# EAGLE board MB_2 (EAGLE 9.2.2)
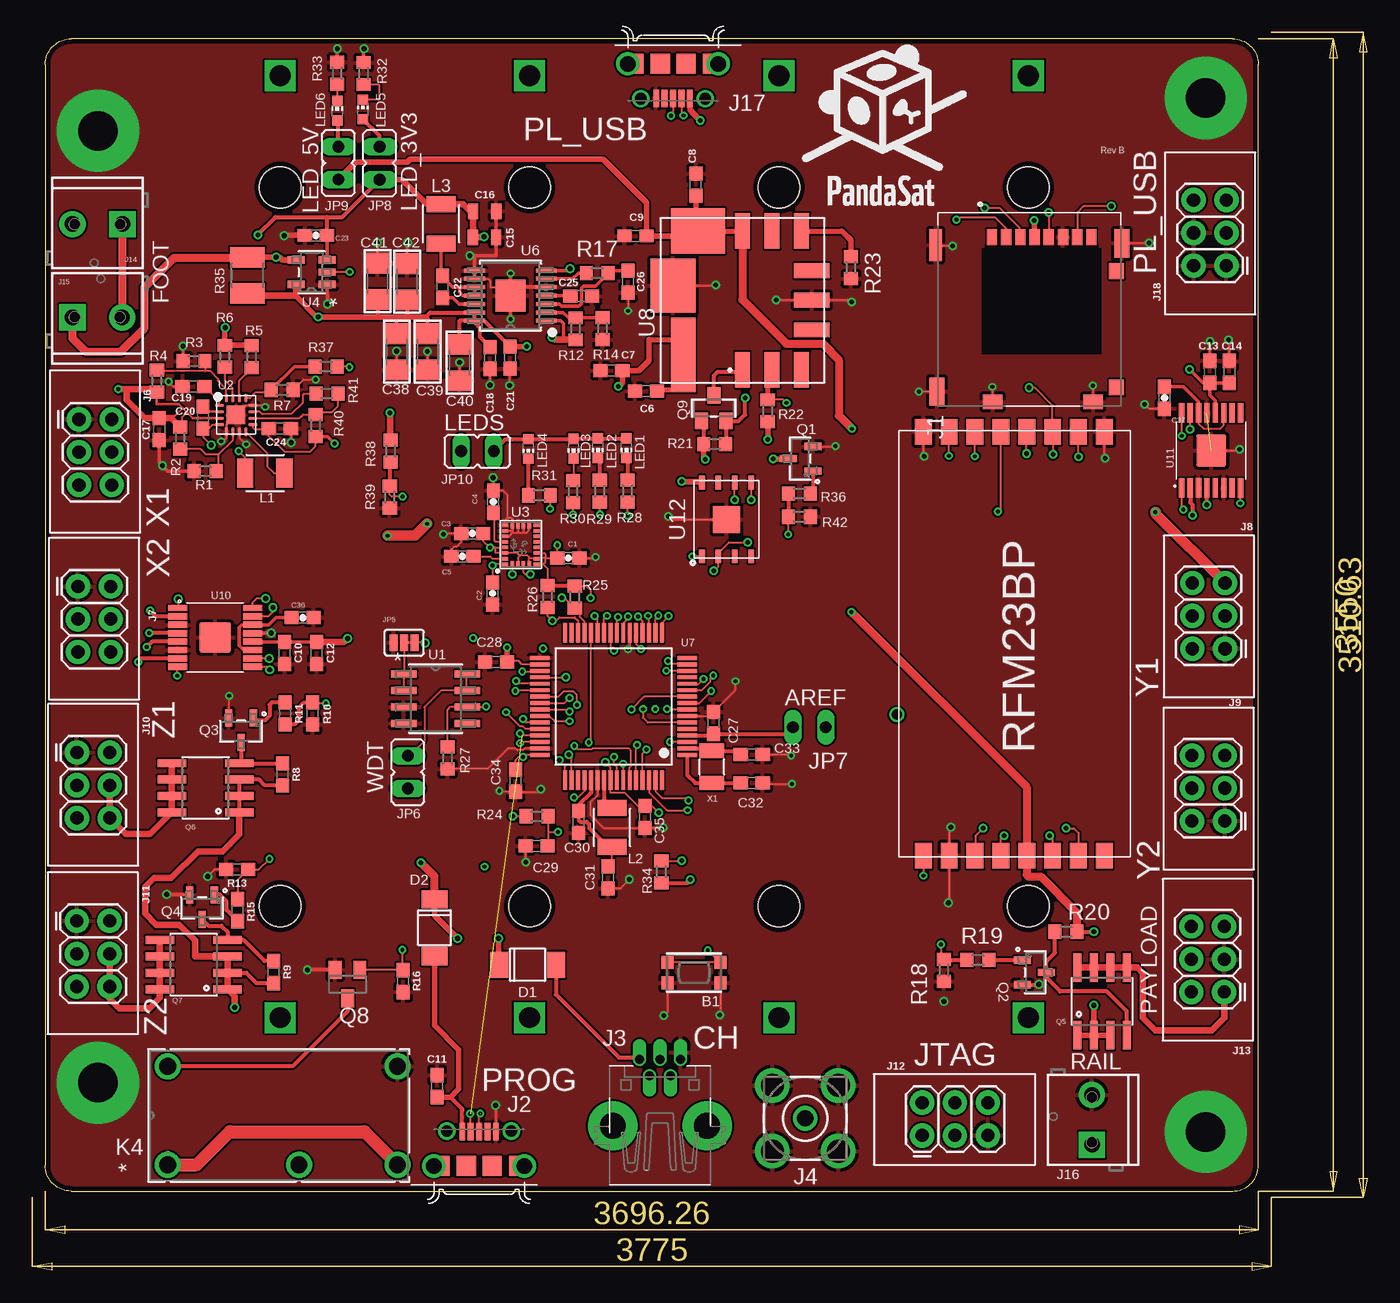
[diagram p4: board, top side]
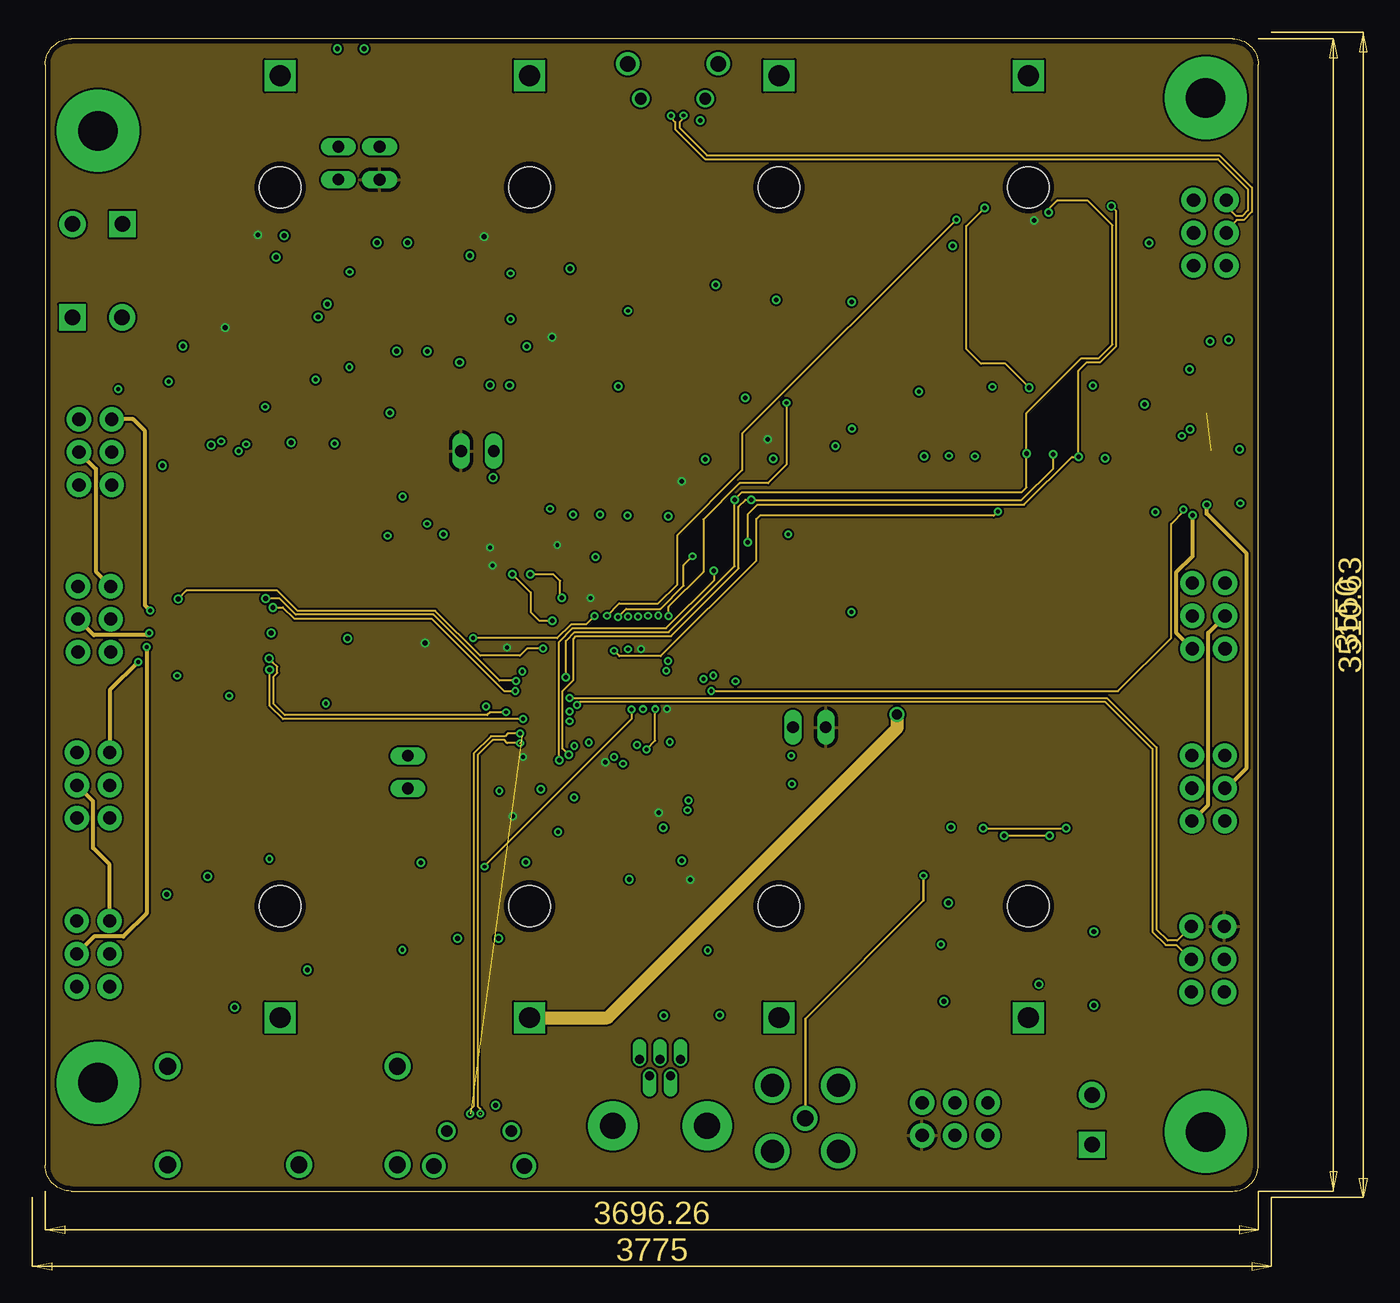
[diagram p5: board, inner layer Route2]
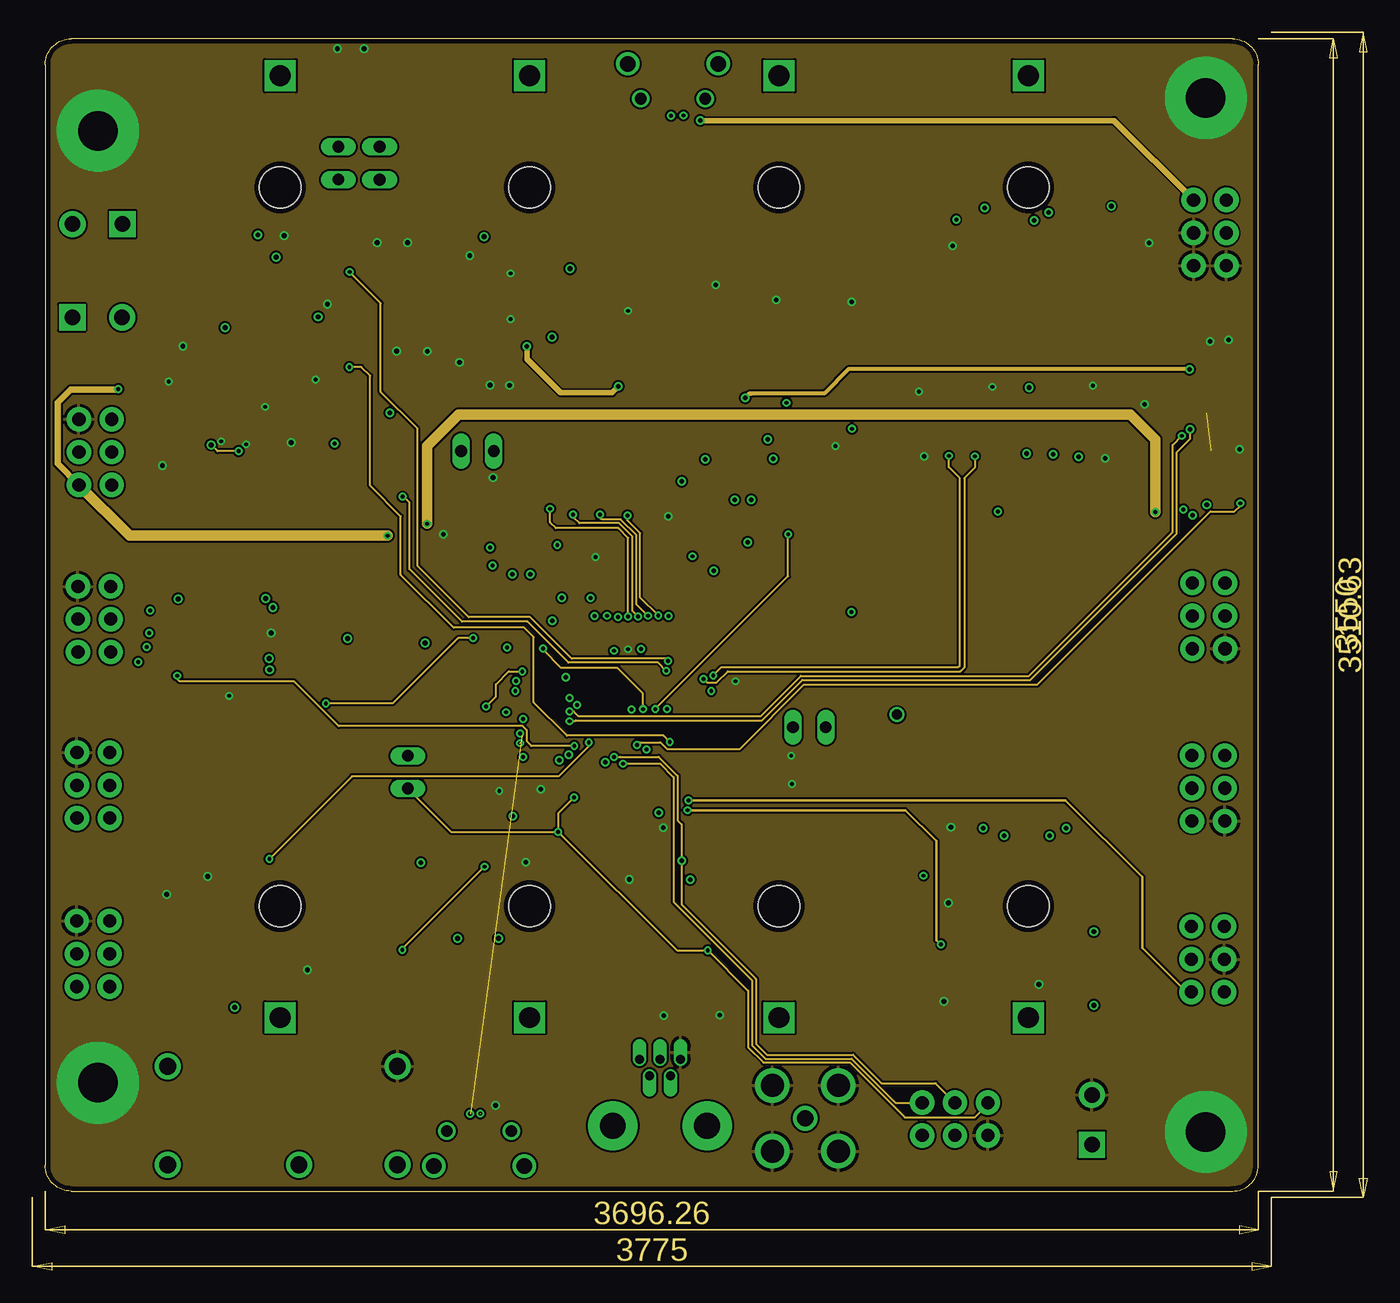
[diagram p6: board, inner layer Route15]
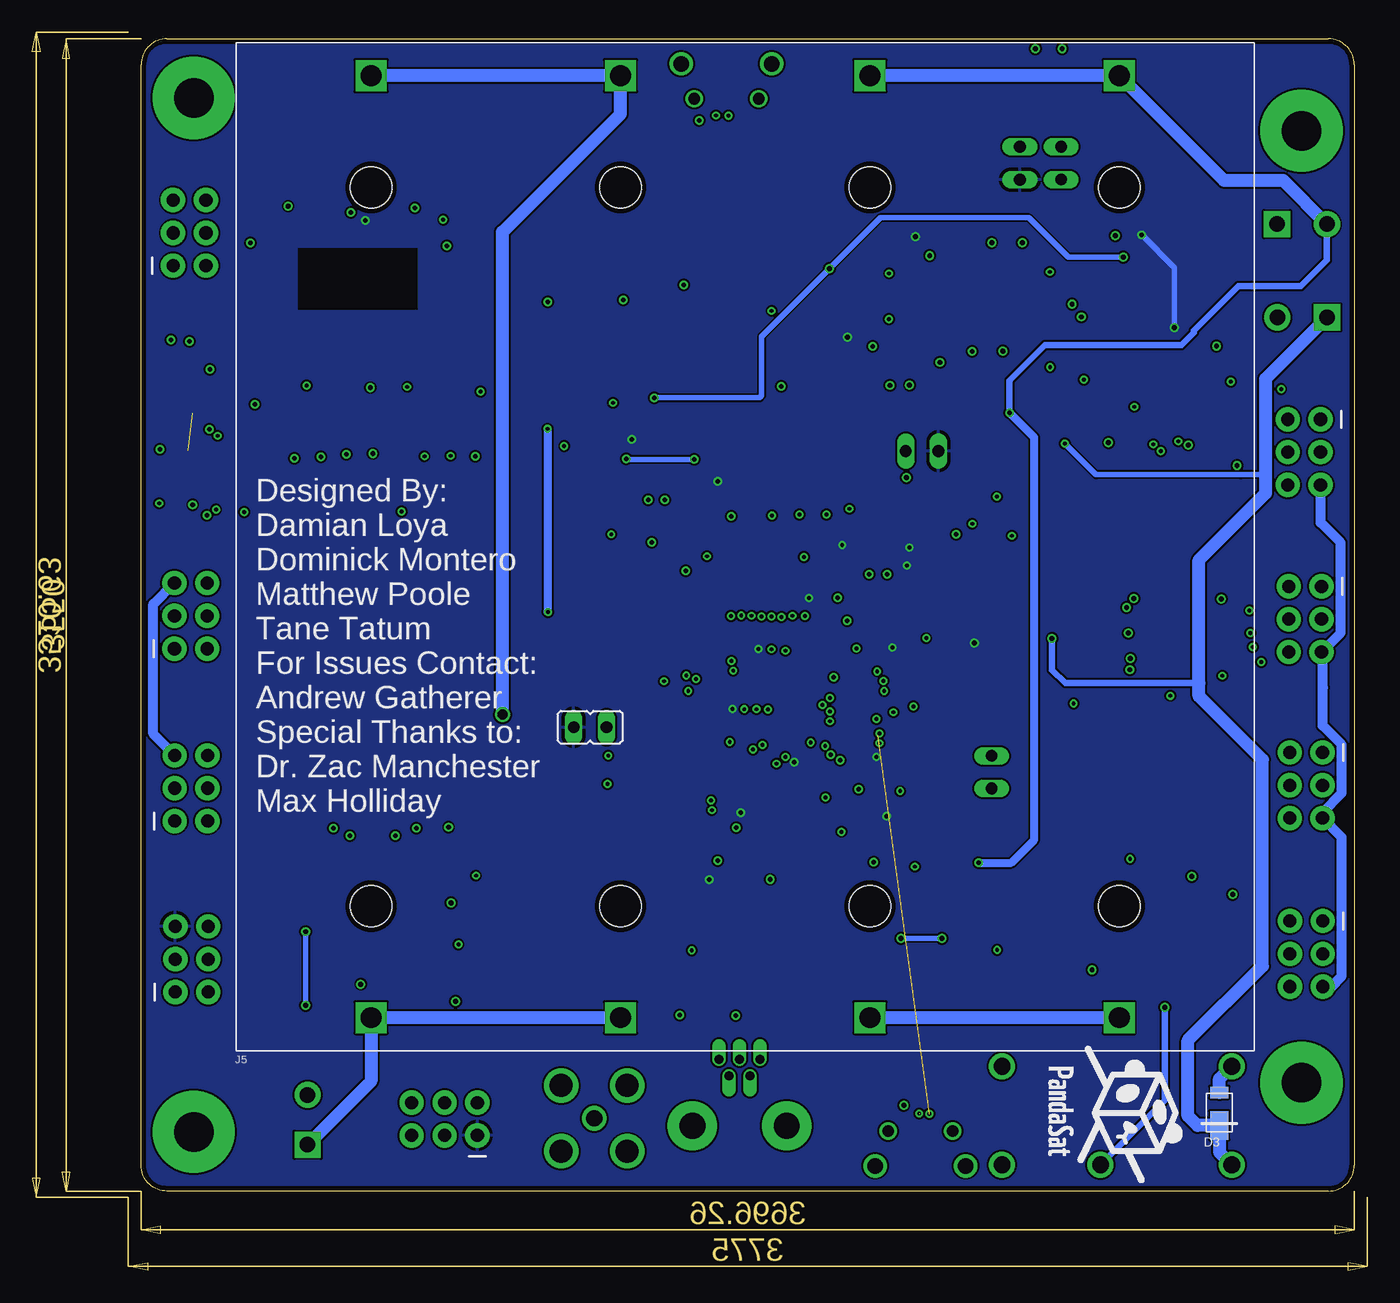
[diagram p7: board, bottom side, seen from below]

Size 93.89 x 89.17 mm. Coordinates in mm from the lower left corner, seen from the top.
Outline: 91.89,89.17 2,89.17 arc90 0,87.17 0,2 arc90 2,0 91.89,0 arc90 93.89,2 93.89,87.17 arc90 91.89,89.17
Copper layers (1*2*15*16): Top 0.035559375mm / dielectric 0.17018125mm / Route2 0.01778125mm / dielectric 47mil / Route15 0.01778125mm / dielectric 0.17018125mm / Bottom 0.035559375mm
Design rules "oshpark-4layer *": minimum track width 6mil, minimum drill 10mil, track to track 6mil, track to pad 6mil, pad to pad 6mil, via to via 6mil, smd to smd 5mil, copper to edge 15mil, drill to drill 6mil, minimum pad ring 0.154940625mm, minimum via ring 0.154940625mm, stop-mask expansion 2.5mil, vias tented up to drill 0mil, thermal gap 10mil
Net classes: 0 default: width 0.152 mm, drill 0.3 mm, clearance 0.127 mm; 1 diff pairs: width 0.203 mm

## Footprints (pad centres in the part's own frame; a part is rotated, then mirrored left to right if it is on the bottom)
BTN_KMR2_4.6X2.8 = smd 0.9 x 1: A 2.05,0.8; A' -2.05,0.8; B 2.05,-0.8; B' -2.05,-0.8
0603-CAP = smd 1.1 x 1: 1 -0.85,0; 2 0.85,0
0603 = smd 1.1 x 1: 1 -0.85,0; 2 0.85,0
0805 = smd 0.8 x 1.2: 1 -0.9,0; 2 0.9,0
C0603 = smd 1.1 x 1: 1 -0.85,0; 2 0.85,0
1206 = smd 1.6 x 1.8: 1 -1.4,0; 2 1.4,0
SOD-128 = smd 2 x 1.4: 1 0,2.2; 2 0,-2.2
PWRDI-123 = smd 0.9 x 1.4: A 1.45,0 | smd 2.2 x 1.4: C -1.1,0
MOLEX_503182-1852 = smd 0.8 x 1.24: 1 -2.9,6.355; 2 -1.8,6.355; 3 -0.7,6.355; 4 0.4,6.355; 5 1.5,6.355; 6 2.6,6.355; 7 3.7,6.355; 8 4.8,6.355 | smd 1.16 x 1.2: DT 6.74,-5.275 | smd 0.95 x 2.5: P1 -7.245,5.725 | smd 1.15 x 2.2: P2 7.145,5.875; P3 -7.145,-5.605 | smd 1.5 x 1.15: P4 -2.84,-6.4; P5 4.94,-6.4 | smd 1.16 x 1.25: SW 6.74,3.725
FRAMATOME_10118194-0001LF = smd 0.45 x 1.35: 1 -1.3,2.675; 2 -0.65,2.675; 3 0,2.675; 4 0.65,2.675; 5 1.3,2.675 | drill 0.9: P$6 -2.5,2.7; P$7 2.5,2.7 | drill 1.2: P$8 -3.5,0; P$9 3.5,0 | smd 1.5 x 1.55: P$10 -1,0; P$11 1,0; P$12 -3.05,0; P$13 3.05,0
USB-MINIB-THM-MOLEX = drill 0.7 offset: D+ 0,9.72; D- -0.8,8.42; GND 1.6,9.72; ID 0.8,8.42; VBUS -1.6,9.72 | drill 2 pad 3.81: GND1 -3.65,4.57; GND4 3.65,4.57
BU-SMA-V = drill 1.27: 1 0,0 | drill 1.778: 2 -2.55,2.55; 3 2.55,2.55; 4 2.55,-2.55; 5 -2.55,-2.55
BK-18650 = drill 1.6 square: 1 -36.45,28.95; 2 -36.45,9.65; 3 -36.45,-9.65; 4 -36.45,-28.95; 5 36.45,-28.95; 6 36.45,-9.65; 7 36.45,9.65; 8 36.45,28.95 | hole 3.2: -27.805,28.95; -27.805,9.65; -27.805,-9.65; 27.805,28.95; -27.805,-28.95; 27.805,-28.95; 27.805,9.65; 27.805,-9.65
2X3 = drill 1.016 pad 1.88: 1 0,0; 2 0,2.54; 3 2.54,0; 4 2.54,2.54; 5 5.08,0; 6 5.08,2.54
SCREWTERMINAL-3.5MM-2_LOCK = drill 1.2 pad 2.032 square: 1 -0.178,0 | drill 1.2 pad 2.032: 2 3.678,0
PAD-JUMPER-3-2OF3_NC_BY_TRACE_YES_SILK_FULL_BOX = smd 0.635 x 1.27: 1 -0.813,0; 2 0,0; 3 0.813,0
JP1 = drill 0.914 long: 1 0,-1.27; 2 0,1.27
RELAY5-PE_CO = drill 1.295 pad 2.007: 1 -7.62,17.196; 5 0,17.196; 11 -7.62,7.036; 12 0,-0.584; 14 -7.62,-0.584
1210 = smd 1.25 x 2.25: 1 -1.54,0; 2 1.5,-0.005
CHIP-LED0603 = smd 0.8 x 0.8: A 0,-0.75; C 0,0.75
SOT-23 = smd 0.559 x 1.321: 1 -0.953,-1.003; 2 0.953,-1.003; 3 0,0.876
SO08 = smd 0.61 x 2.21: 1 -1.905,-2.616; 2 -0.635,-2.616; 3 0.635,-2.616; 4 1.905,-2.616; 5 1.905,2.616; 6 0.635,2.616; 7 -0.635,2.616; 8 -1.905,2.616
SOT23 = smd 1 x 1.4: 1 -0.95,-1.1; 2 0.95,-1.1; 3 0,1.1
SOT23-WIDE = smd 1 x 1.27: 1 -0.95,-1; 2 0.95,-1; 3 0,1
R0603 = smd 1 x 1.1: 1 -0.85,0; 2 0.85,0
R1210 = smd 1.6 x 2.7: 1 -1.4,0; 2 1.4,0
SO8 = smd 1.981 x 0.533: 1 -2.464,1.905; 2 -2.464,0.635; 3 -2.464,-0.635; 4 -2.464,-1.905; 5 2.464,-1.905; 6 2.464,-0.635; 7 2.464,0.635; 8 2.464,1.905
QFN-16-PAD = smd 0.7 x 0.25: P$1 -1.3,0.75; P$2 -1.3,0.25; P$3 -1.3,-0.25; P$4 -1.3,-0.75; P$9 1.3,-0.75; P$10 1.3,-0.25; P$11 1.3,0.25; P$12 1.3,0.75 | smd 0.25 x 0.7: P$5 -0.75,-1.3; P$6 -0.25,-1.3; P$7 0.25,-1.3; P$8 0.75,-1.3; P$13 0.75,1.3; P$14 0.25,1.3; P$15 -0.25,1.3; P$16 -0.75,1.3 | smd 1.45 x 1.45: P$17 0,0
LGA24-8X4 = smd 0.27 x 0.45: 1 -1.505,1.225; 6 -1.505,-1.225; 7 -1.075,-1.225; 8 -0.645,-1.225; 9 -0.215,-1.225; 10 0.215,-1.225; 11 0.645,-1.225; 12 1.075,-1.225; 13 1.505,-1.225; 18 1.505,1.225; 19 1.075,1.225; 20 0.645,1.225; 21 0.215,1.225; 22 -0.215,1.225; 23 -0.645,1.225; 24 -1.075,1.225 | smd 0.45 x 0.27: 2 -1.475,0.645; 3 -1.475,0.215; 4 -1.475,-0.215; 5 -1.475,-0.645; 14 1.475,-0.645; 15 1.475,-0.215; 16 1.475,0.215; 17 1.475,0.645
21-0057F = smd 1.321 x 0.559: 1 -1.194,0.95; 2 -1.194,0; 3 -1.194,-0.95; 4 1.194,-0.95; 5 1.194,0.95
RFM23BP = smd 2 x 1.3: ANT 16.9,-7.5; GND1 -15.9,6.5; GND2 -15.9,-7.5; GND3 16.9,-5.5; GPIO_0 16.9,2.5; GPIO_1 16.9,4.5; GPIO_2 16.9,6.5; NIRQ -15.9,-3.5; NSEL -15.9,-1.5; RXON 16.9,-1.5; SCK -15.9,0.5; SDI -15.9,2.5; SDN -15.9,-5.5; SDO -15.9,4.5; TXON 16.9,-3.5; VCC 16.9,0.5
PWP14_2P31X2P46-L = smd 1.6 x 0.305: 1 -2.769,1.95; 2 -2.769,1.3; 3 -2.769,0.65; 4 -2.769,0; 5 -2.769,-0.65; 6 -2.769,-1.3; 7 -2.769,-1.95; 8 2.769,-1.95; 9 2.769,-1.3; 10 2.769,-0.65; 11 2.769,0; 12 2.769,0.65; 13 2.769,1.3; 14 2.769,1.95 | smd 2.31 x 2.46: 15 0,0
TQFP-64 = smd 1.5 x 0.3: 1 5.7,-3.75; 2 5.7,-3.25; 3 5.7,-2.75; 4 5.7,-2.25; 5 5.7,-1.75; 6 5.7,-1.25; 7 5.7,-0.75; 8 5.7,-0.25; 9 5.7,0.25; 10 5.7,0.75; 11 5.7,1.25; 12 5.7,1.75; 13 5.7,2.25; 14 5.7,2.75; 15 5.7,3.25; 16 5.7,3.75; 33 -5.7,3.75; 34 -5.7,3.25; 35 -5.7,2.75; 36 -5.7,2.25; 37 -5.7,1.75; 38 -5.7,1.25; 39 -5.7,0.75; 40 -5.7,0.25; 41 -5.7,-0.25; 42 -5.7,-0.75; 43 -5.7,-1.25; 44 -5.7,-1.75; 45 -5.7,-2.25; 46 -5.7,-2.75; 47 -5.7,-3.25; 48 -5.7,-3.75 | smd 0.3 x 1.5: 17 3.75,5.7; 18 3.25,5.7; 19 2.75,5.7; 20 2.25,5.7; 21 1.75,5.7; 22 1.25,5.7; 23 0.75,5.7; 24 0.25,5.7; 25 -0.25,5.7; 26 -0.75,5.7; 27 -1.25,5.7; 28 -1.75,5.7; 29 -2.25,5.7; 30 -2.75,5.7; 31 -3.25,5.7; 32 -3.75,5.7; 49 -3.75,-5.7; 50 -3.25,-5.7; 51 -2.75,-5.7; 52 -2.25,-5.7; 53 -1.75,-5.7; 54 -1.25,-5.7; 55 -0.75,-5.7; 56 -0.25,-5.7; 57 0.25,-5.7; 58 0.75,-5.7; 59 1.25,-5.7; 60 1.75,-5.7; 61 2.25,-5.7; 62 2.75,-5.7; 63 3.25,-5.7; 64 3.75,-5.7
OKL-T3-W12 = smd 2.75 x 1.15: 1 -5.37,0; 5 5.37,0; 6 5.37,-4.57; 9 -5.37,-4.57; 10 -5.37,-2.29; 11 5.37,-2.29 | smd 5.78 x 1.905: 2 -4.23,4.57 | smd 4.18 x 3.505: 3 1.14,5.37 | smd 3.505 x 4.18: 4 5.37,3.43 | smd 1.15 x 2.75: 7 0,-5.37; 8 -2.29,-5.37; 12 2.29,-5.37
HTSSOP = smd 1.5 x 0.45: 1 -2.9,1.95; 2 -2.9,1.3; 3 -2.9,0.65; 4 -2.9,0; 5 -2.9,-0.65; 6 -2.9,-1.3; 7 -2.9,-1.95; 8 -2.91,-2.6; 9 2.9,-2.6; 10 2.9,-1.95; 11 2.9,-1.3; 12 2.9,-0.65; 13 2.9,0; 14 2.9,0.65; 15 2.9,1.3; 16 2.9,1.95 | smd 2.46 x 2.31: PPAD -0.005,-0.33
SON127P600X500X90-9N = smd 1.05 x 0.45: 1 -2.85,1.905; 2 -2.85,0.635; 3 -2.85,-0.635; 4 -2.85,-1.905; 5 2.85,-1.905; 6 2.85,-0.635; 7 2.85,0.635; 8 2.85,1.905 | smd 2.1 x 2.1: 9 0,0
ECX-31B = smd 1.1 x 1.9: 1 0.55,-0.95; 2 3.05,-0.95

## Placement (x,y rotation side)
B1  [BTN_KMR2_4.6X2.8]  50.21,16.9 180 top
C1  10uF  [0603-CAP]  40.48,48.98 0 top
C2  0.1uF  [0603-CAP]  34.61,46.25 270 top
C3  0.1uF  [0603-CAP]  33.04,50.9 180 top
C4  10nF  [0603-CAP]  34.67,53.34 90 top
C5  0.1uF  [0603-CAP]  32.28,49.12 180 top
C6  10uF  [0603]  46.49,61.91 180 top
C7  22uF  [0603]  43.81,63.48 180 top
C8  10uF  [0603]  50.35,77.88 90 top
C9  47uF  [0603]  45.68,73.91 180 top
C10  100nF  [0603]  18.52,41.64 270 top
C11  2.2uF  [0603]  30.33,8.12 90 top
C12  10uF  [0603]  21.01,41.63 270 top
C13  100nF  [0603]  90.13,63.4 90 top
C14  10uF  [0603]  91.62,63.39 90 top
C15  22uF  [0805]  33.98,73.81 180 top
C16  22uF  [0805]  34,75.81 180 top
C17  10uF  [0603]  8.83,58.97 270 top
C18  10uF  [0603]  34.41,64.47 270 top
C19  2.2uF  [0603]  11.47,62.26 180 top
C20  22nF  [0603]  12.2,59.86 270 top
C21  10uF  [0603]  35.98,64.49 270 top
C22  0.1uF  [0603]  30.75,69.97 270 top
C23  .1uF  [0603-CAP]  20.94,73.95 180 top
C24  22uF  [0603]  18.17,59.01 0 top
C25  3.3nF  [0603]  41.47,69.26 0 top
C26  1.0uF  [0603]  45.09,70.37 270 top
C27  1uF  [C0603]  51.72,36.23 270 top
C28  10uF  [C0603]  34.9,40.95 0 top
C29  1uF  [C0603]  38.01,26.7 0 top
C30  10uF  [C0603]  41.28,28.56 90 top
C31  1uF  [C0603]  43.55,24.28 90 top
C32  22pF  [C0603]  54.67,31.59 0 top
C33  22pF  [C0603]  54.67,33.77 0 top
C34  1uF  [C0603]  36.4,31.75 90 top
C35  1uF  [C0603]  46.41,28.95 90 top
C36  2.2uF  [0603-CAP]  19.93,44.37 0 top
C37  2.2uF  [0603-CAP]  86.61,61.39 270 top
C38  [1206]  27.21,64.95 270 top
C39  [1206]  29.6,64.95 270 top
C40  [1206]  32.07,64.11 270 top
C41  [1206]  25.72,70.4 90 top
C42  [1206]  28,70.37 90 top
D1  [SOD-128]  37.33,17.51 90 top
D2  [SOD-128]  30.12,20.38 0 top
D3  SBR2A40P1Q-7  [PWRDI-123]  10.44,6.18 90 bottom
J1  503182-1852  [MOLEX_503182-1852]  76.16,67.47 0 top
J2  10118194-0001LF  [FRAMATOME_10118194-0001LF]  33.57,1.94 0 top
J3  [USB-MINIB-THM-MOLEX]  47.57,0.48 0 top
J4  BU-SMA-V  [BU-SMA-V]  58.82,5.63 0 top
J5  BK-18650  [BK-18650]  47.13,49.86 90 bottom
J6  [2X3]  2.61,59.72 270 top
J7  [2X3]  2.53,46.79 270 top
J8  [2X3]  91.3,41.97 90 top
J9  [2X3]  91.28,28.63 90 top
J10  [2X3]  2.45,33.94 270 top
J11  [2X3]  2.44,20.9 270 top
J12  [2X3]  67.86,4.3 0 top
J13  [2X3]  91.23,15.4 90 top
J14  M023.5MM_LOCK  [SCREWTERMINAL-3.5MM-2_LOCK]  5.8,74.83 180 top
J15  M023.5MM_LOCK  [SCREWTERMINAL-3.5MM-2_LOCK]  2.28,67.62 0 top
J16  M023.5MM_LOCK  [SCREWTERMINAL-3.5MM-2_LOCK]  81,3.76 90 top
J17  10118194-0001LF  [FRAMATOME_10118194-0001LF]  48.58,87.23 180 top
J18  [2X3]  91.41,71.61 90 top
JP5  [PAD-JUMPER-3-2OF3_NC_BY_TRACE_YES_SILK_FULL_BOX]  27.77,42.44 0 top
JP6  [JP1]  28.06,32.42 180 top
JP7  [JP1]  59.13,35.89 90 bottom
JP8  [JP1]  25.88,79.54 180 top
JP9  [JP1]  22.68,79.55 180 top
JP10  [JP1]  33.44,57.26 90 top
K4  PE014006  [RELAY5-PE_CO]  26.67,9.66 90 top
L1  56uH  [1210]  17.01,55.56 0 top
L2  10uH  [1210]  43.86,28.16 90 top
L3  3.3uH  [1210]  30.63,74.86 90 top
LED1  [CHIP-LED0603]  44.97,57.49 180 top
LED2  [CHIP-LED0603]  42.76,57.49 180 top
LED3  [CHIP-LED0603]  40.88,57.46 180 top
LED4  [CHIP-LED0603]  37.38,57.44 180 top
LED5  [CHIP-LED0603]  24.58,83.7 0 top
LED6  [CHIP-LED0603]  22.6,83.6 0 top
Q1  IRLML2803  [SOT-23]  58.41,56.68 90 top
Q2  IRLML2803  [SOT-23]  76.6,16.93 270 top
Q3  IRLML2803  [SOT-23]  15.16,35.59 180 top
Q4  IRLML2803  [SOT-23]  12.14,21.91 180 top
Q5  MOSFET-PCHANNEL-SOIC8SOIC8  [SO08]  81.79,14.68 0 top
Q6  MOSFET-PCHANNEL-SOIC8SOIC8  [SO08]  12.41,31.2 90 top
Q7  MOSFET-PCHANNEL-SOIC8SOIC8  [SO08]  11.49,17.52 90 top
Q8  2N5088  [SOT23]  23.4,16.01 180 top
Q9  [SOT23-WIDE]  51.74,60.59 0 top
R1  43K  [R0603]  12.37,55.71 0 top
R2  330K  [R0603]  10.44,58.26 90 top
R3  100K  [R0603]  11.51,64.22 180 top
R4  40.9K  [R0603]  8.64,62.68 270 top
R5  470k  [R0603]  15.97,64.57 90 top
R6  4.7k  [R0603]  13.9,64.6 90 top
R7  6.04K  [R0603]  18.34,62 180 top
R8  100k  [0603]  18.37,32.24 270 top
R9  100k  [0603]  17.66,16.95 270 top
R10  10k  [0603]  20.69,36.95 270 top
R11  4.7k  [0603]  18.57,36.96 270 top
R12  73.2K  [R0603]  41.05,66.72 270 top
R13  10k  [0603]  14.85,24.88 180 top
R14  22.1k  [R0603]  43.13,66.73 90 top
R15  4.7k  [0603]  14.9,21.74 90 top
R16  10k  [0603]  27.68,16.25 270 top
R17  100K  [R0603]  42.72,71.04 0 top
R18  10K  [R0603]  69.54,17.09 270 top
R19  4.7K  [R0603]  72.17,17.88 0 top
R20  3.3K  [R0603]  78.99,20.07 180 top
R21  3.3K  [R0603]  51.81,57.81 180 top
R22  100k  [R0603]  55.91,60.38 90 top
R23  1.34K  [R0603]  62.35,71.47 270 top
R24  10K  [R0603]  38.06,29 0 top
R25  4K7  [R0603]  40.97,45.97 270 top
R26  4K7  [R0603]  38.87,45.99 270 top
R27  10K  [R0603]  31.14,33.52 270 top
R28  330  [R0603]  45.07,54.17 90 top
R29  330  [R0603]  42.91,54.16 90 top
R30  330  [R0603]  40.85,54.14 90 top
R31  330  [R0603]  38.23,53.84 180 top
R32  62  [R0603]  24.63,86.48 270 top
R33  130  [R0603]  22.59,86.5 270 top
R34  10K  [R0603]  47.68,24.71 270 top
R35  0.025  [R1210]  15.65,70.86 90 top
R36  4.7K  [R0603]  58.37,53.98 0 top
R37  10K  [R0603]  21.73,63.81 180 top
R38  665K  [R0603]  26.74,57.26 90 top
R39  330K  [R0603]  26.66,53.7 90 top
R40  2.1M  [R0603]  20.92,59.25 90 top
R41  845K  [R0603]  21.8,61.71 0 top
R42  10K  [R0603]  58.35,52.18 0 top
U1  MAX706R  [SO8]  30.21,38.1 0 top
U2  LTC4121-4.2  [QFN-16-PAD]  14.77,60.06 0 top
U3  LSM9DS1  [LGA24-8X4]  36.8,50.02 90 top
U4  MAX4372TEUK+T  [21-0057F]  20.61,71.1 180 top
U5  RFM23BP  [RFM23BP]  75.45,42.85 270 top
U6  TPS54226PWPRPWP14_2P31X2P46-L  [PWP14_2P31X2P46-L]  36,69.29 180 top
U7  ATSAMD51  [TQFP-64]  43.98,37.51 0 top
U8  OKL-T3-W12  [OKL-T3-W12]  53.96,68.93 90 top
U10  DRV8848  [HTSSOP]  13.16,43.17 0 top
U11  DRV8848  [HTSSOP]  89.89,57.32 90 top
U12  MR25H40MDF  [SON127P600X500X90-9N]  52.72,51.98 90 top
X1  [ECX-31B]  50.64,31.02 90 top

## Tracks (layer width: path | path; a pad name or v marks a point on that pad's centre or on a via)
3.3V  (via drill 0.3, 0.35, 0.38)
  Top 0.152: C34.2 36.4,33.35 36.64,33.59 v36.97,33.59 37.15,33.76 U7.48 | v35.75,42.06 | U3.5 37.44,48.97 | 37.44,48.97 37.44,49.07 37.33,49.18 36.74,49.18 | 36.74,49.18 36.58,49.02 U3.3 | 36.74,49.18 36.55,49.38 U3.23 34.83,49.38 34.83,49.79 | U7.8 48.75,37.26 48.74,37.26 48.14,37.26 v48.11,37.29 | JP5.3 29.36,42.44 v29.4,42.4 | U3.8 38.62,49.38 38.7,49.3 38.7,48.98 | 38.7,48.98 38.06,48.98 U3.7 37.46,48.95 37.44,48.97 | U3.6 38.53,48.52 | 38.53,48.52 38.7,48.69 38.7,48.97 | 38.7,48.97 38.7,48.98 | 38.53,48.52 38.88,48.17 R26.1 | v43.34,33.18 43.73,32.79 U7.56 43.73,30.86 43.76,30.83 44.82,30.83 45.86,29.8 C35.2 46.97,29.8 v47.48,29.29 | R24.1 v36.19,29 v36.18,29.01 | U7.34 36.91,40.76 36.66,41.01 35.81,41.01 C28.2 | 38.7,48.97 38.71,48.98 C1.1 39.63,49.98 v39.62,49.99 | U3.1 34.74,48.52 v34.62,48.41 34.6,48.38 34.6,47.11 C2.1 | C3.1 33.89,50.32 v34.41,49.8 34.83,49.8 34.83,49.79 | R25.1 41.9,46.82 42.2,46.53 v42.2,45.91 | U7.21 45.73,42.33 v46.11,41.96 | U3.22 35.56,49.79 34.83,49.79
  Top 0.254: U4.3 21.8,73.82 C23.1 | U6.1 39.87,67.34 40.1,67.11 40.1,65.95 40.17,65.87 40.53,65.87 R12.2
  Top 0.305: v16.45,74 17.82,75.37 21.81,75.37 | 21.81,75.37 22.98,75.37 JP8.2 | C23.1 21.81,73.97 21.81,75.37 | R26.1 40.95,46.84 R25.1 | R34.2 49.68,23.86 v49.91,24.09
  Top 0.406: L3.2 29.53,76.36 27.63,78.27 JP8.2 | R5.2 15.95,65.44 R6.2 13.9,66.8 v13.91,66.81 | C28.2 v35.75,42.06 | R22.1 v55.91,58.17 | J1.4 76.56,75.06 v76.51,75.1
  Top 0.457: v49.27,54.92 49.34,54.85 50.79,54.85 U12.8
  Top 0.508: L3.2 32.32,76.36 32.86,75.83 33.09,75.83 C16.2 33.1,73.83 C15.2 | v33.97,73.84 33.94,73.81 C15.2 | C15.2 | v39.23,66.07 39.44,65.87 40.53,65.87
  Bottom 0.406: v13.91,66.81 13.91,71.46 v16.45,74
  pour Bottom: -2.65,92.46 97.43,92.46 97.43,-3.55 -2.65,-3.55
  pour Route2: -4.86,94.45 -4.86,-5.83 81.02,-5.83 100.75,-5.83 100.75,94.98 -4.86,94.98
5V  (via drill 0.3, 0.38)
  Top 0.305: v81.15,14.38 v81.14,14.38 | R20.1 v81.14,20.07
  Top 0.381: U8.4 U8.5
  Top 0.406: U8.4 50.61,74.48 50.35,74.21 | C8.1 50.35,74.21 | 50.35,74.21 49.93,73.8 49.81,73.91 C9.1 46.53,76.5 43.17,79.85 28.23,79.85 28,79.62 24.02,79.62 JP9.2 | Q5.2 v81.15,14.38 | Q5.1 Q5.2 | Q5.2 Q5.3
  Top 0.61: R20.1 79.84,21.53 77.03,24.34 76.09,24.34 75.95,24.48 U5.VCC 75.95,31.26 v62.4,44.81 | v62.43,58.99 61.41,60.01 61.41,64.32 60.16,65.56 57.36,65.56 53.96,68.97 U8.5
  Bottom 0.406: v81.14,20.07 v81.14,14.38
  Bottom 0.61: v62.43,58.99 62.43,44.84 v62.4,44.81
5V_EN  (via drill 0.3)
  Top 0.152: U7.61 46.23,33.88 v46.54,34.19 | v57.5,50.83 R42.1
  Top 0.305: R36.1 57.52,52.2 R42.1
  Route2 0.152: v46.54,34.19 47.21,34.85 v47.21,37.29
  Route15 0.152: v47.21,37.29 v47.21,37.3 57.49,47.58 v57.49,50.82 v57.5,50.83
!RESET  (via drill 0.3)
  Top 0.152: U7.52 41.73,30.97 41.23,30.46 v40.92,30.46 | R24.2 38.91,27.84 | 38.91,27.84 38.91,26.75 C29.2 | 38.91,27.84 38.95,27.8 v39.69,27.8 | v51.27,18.62 52.2,17.7 B1.B' B1.B
  Route15 0.152: JP6.2 31.4,27.8 v39.69,27.8 | v40.92,30.46 39.69,29.23 v39.69,27.8 | v39.69,27.8 48.87,18.62 v51.27,18.62 54.39,15.5 54.39,11.12 55.56,9.94 62.26,9.94 66.51,5.69 71.94,5.69 72.94,6.7 J12.6
A_VLEV  (via drill 0.3)
  Top 0.152: U7.14 v48.06,40.26 | v27.66,53.73 26.82,53.73 26.66,53.88 R39.2
  Top 0.305: R38.1 26.66,56.33 R39.2
  Route15 0.152: v48.06,40.26 47.43,40.89 40.49,40.89 37.31,44.07 32.24,44.07 28.18,48.13 28.18,53.28 27.73,53.73 v27.66,53.73
AREF
  Top 0.152: 51.7,35.36 C27.2
  Top 0.305: U7.4 51.6,35.26 51.7,35.36 | C27.2 57.35,35.38 JP7.1
BURN_RELAY_A  (via drill 0.3)
  Top 0.152: R16.1 27.64,17.1 | 27.64,17.1 24.36,17.1 Q8.1 | U7.10 46.35,38.26 v45.37,37.28 | v27.64,18.66 27.64,17.1
  Route2 0.152: v45.37,37.28 45.37,36.52 34,25.15 v34,25.11
  Route15 0.152: v34,25.11 27.64,18.74 v27.64,18.66
DXZ_FAULT  (via drill 0.3)
  Top 0.152: v10.21,39.88 10.21,40.54 U10.8 | U7.59 45.23,32.8 45.33,32.89 45.33,34.1 45.18,34.24 42.35,34.24 42.28,34.18 41.2,34.18 v40.94,34.44
  Route15 0.152: v40.94,34.44 37.63,34.44 37.28,34.8 37.28,35.64 36.94,35.98 22.72,35.98 19.26,39.44 10.42,39.44 10.23,39.62 v10.23,39.87 v10.21,39.88
DY_FAULT  (via drill 0.3)
  Top 0.152: U7.60 45.73,34.45 v45.79,34.52 | v92.48,53.22 92.48,54.39 U11.8
  Route15 0.152: v45.79,34.52 46.01,34.73 47.6,34.73 48.1,34.23 53.77,34.23 58.73,39.19 76.77,39.19 90.17,52.59 92.03,52.59 92.51,53.06 92.51,53.2 v92.48,53.22
ENAB_BURN1  (via drill 0.3)
  Top 0.152: U7.27 42.73,44.27 v42.51,44.5 | v21.72,37.74 20.65,37.74 20.64,37.75
  Top 0.305: R10.1 20.64,37.75 19.95,37.75 19.6,37.4 19.6,36.43 19.28,36.11 R11.2
  Route2 0.152: v42.51,44.5 41.87,43.86 40.7,43.86 39.62,42.79 v33.12,42.79
  Route15 0.152: v33.12,42.79 31.94,42.79 26.9,37.74 v21.72,37.74
ENAB_BURN2  (via drill 0.3)
  Top 0.152: R15.2 14.9,24.08 R13.1 15.86,24.88 15.87,24.89 16.53,24.89 v17.35,25.7 | U7.28 42.22,42.48 42.21,42.47 42.21,34.86 v42.06,34.71
  Route15 0.152: v17.35,25.7 23.73,32.09 39.73,32.09 42.06,34.41 v42.06,34.71
GND  (via drill 0.3, 0.35, 0.38, 3.05 pad 6.35)  (1 unrouted)
  Top 0.152: U2.P$17 15.49,60.78 16.04,60.78 U2.P$12 16.84,60.81 16.96,60.69 v17.01,60.69 | C24.2 v19.02,57.92 | C27.1 51.63,37.08 | C16.1 35.14,75.58 | v34.66,55.23 34.68,55.21 C4.2 35.43,54.19 35.76,53.86 35.76,52.11 | 35.97,69.66 35.97,69.32 U6.15 | 35.97,69.66 35.97,69.96 34.43,69.96 34.43,70.42 34.26,70.59 U6.9 | 35.97,69.66 36,69.68 | v15.55,57.78 15.02,58.32 U2.P$7 | v13.62,58.02 13.77,58.02 14.02,58.26 U2.P$5 14.02,59.1 14.04,59.13 14.04,59.34 U2.P$17 | R7.1 19.98,62.8 v20.92,62.8 | U2.P$17 14.77,60.02 | 58.84,68.93 58.46,69.31 | B1.A 48.16,13.86 v47.87,13.57 | B1.A' 52.26,13.67 v52.21,13.62 | U7.22 45.23,42.06 v45.1,41.93 | U7.54 42.73,30.62 42.18,30.07 42.18,29.14 43.21,28.1 C35.1 | 36.15,51.04 U3.17 36.15,52 36.04,52.11 35.76,52.11 | 36.15,51.04 36.15,50.98 36.18,50.96 | U3.14 37.44,51.14 37.26,50.96 37.01,50.96 | 36.18,50.96 36.59,50.96 | 36.59,50.96 37.01,50.96 | U3.16 36.58,50.97 36.59,50.96 | U3.15 37.01,50.96 | U3.19 36.09,51.1 36.15,51.04 | U3.20 35.89,50.67 36.18,50.96 | U3.18 35.57,51.92 35.76,52.11 | U7.7 51.4,36.76 C27.1 | U7.47 37.1,34.26 36.97,34.12 36.52,34.12 36.39,34.26 35.82,34.26 34.23,32.67 R27.2 | v38.36,31.09 38.18,30.9 C34.1 35.19,30.9 v35.14,30.95 | C5.2 31.43,49.66 31.62,49.85 31.82,49.85 32.19,50.22 C3.2 30.88,50.9 v30.8,50.82 | C1.2 42.48,48.98 v42.57,49.07 | Q3.2 14.23,36.62 v14.23,38.33 | C32.2 55.59,31.51 v57.77,31.51 | C33.2 57.65,33.77 v57.73,33.69 | C27.1 53.4,38.76 v53.4,39.46 | C26.2 v45.09,68.11 v45.08,68.11 | Q1.2 61.11,57.63 v61.14,57.66 | J1.P3 67.63,61.87 v67.62,61.88 | J1.P4 73.32,62.19 v73.28,62.23 | J1.P5 81.1,62.31 v81.07,62.34
  Top 0.203: v69.89,22.31 69.95,22.37 U5.GND3 69.95,28.02 v70.08,28.15 | J2.5 v34.88,6.62 v34.87,6.62 | R13.2 13.1,24.88 v12.56,24.34 | C19.2 9.9,62.26 9.56,62.61 v9.56,62.63 | R3.2 v10.66,65.39 | C41.2 25.72,73.38 v25.7,73.4 | C42.2 28,73.35 v28.06,73.4 | C38.2 27.21,64.99 v27.19,65.01 | C39.2 29.6,64.95 v29.57,64.98 | C40.2 v32.07,64.13 | C18.2 v34.41,62.37 | C21.2 35.93,63.59 v35.93,62.35 | 58.46,69.31 58.53,69.31 | U5.GND2 67.95,56.91 v68.02,56.84 | U5.GND1 81.95,56.75 v82,56.7 | v56.56,68.97 56.6,68.93 U8.7 62.26,68.93 v62.39,68.8 | J1.P1 68.96,73.15 v70.21,73.15 | J1.P2 85.39,73.34 v85.42,73.38 | C13.2 v90.12,65.76 | C14.2 91.62,65.84 v91.58,65.88 | C37.2 85.44,60.54 v85.09,60.89 | U11.PPAD 92.32,57.31 v92.42,57.41 | U8.3 51.82,70.07 v51.89,70.14 | U12.9 48.45,51.98 v48.22,52.21 | C35.1 47.79,28.1 v47.81,28.12 | C31.1 44.51,23.43 v45.21,24.12 | C29.1 37.16,25.51 v37.21,25.47
  Top 0.254: U4.1 v21.84,68.64 | U6.9 U6.8 33.23,72.39 | R16.2 27.66,15.38 | R1.1 9.49,55.71 v9.07,56.13 8.83,56.37 C17.2 | 36,69.68 v36,71.01 | U6.15 36,67.5 v36.02,67.48 | 34.65,76.06 C16.1 34.88,75.79 C15.1 34.88,72.39 33.23,72.39 | 33.23,72.39 v32.86,72.39 | JP5.1 27.07,42.44 | C35.1 46.54,27.96 | R33.1 22.59,88.4 v22.61,88.4 | R32.1 24.63,88.4 v24.67,88.4
  Top 0.272: U10.13 arc90 U10.13 v17.48,43.17 | U10.3
  Top 0.305: Q4.2 v9.41,22.94 | Q8.2 20.3,17.11 v20.29,17.13 | Q2.2 76.84,15.97 v76.88,16.01 | v69.53,14.69 v69.54,14.69 | 82.01,58.81 U5.GND1 | U11.3 89.27,54.44 | U6.5 36.65,69.94 U6.15
  Top 0.381: 69.09,61.78 J1.P3 69.01,61.9 68.9,62.01
  Top 0.406: C23.2 18.51,73.95 v18.48,73.92
  Route15 0.203: v37.21,25.47 37.19,25.47 37.18,25.48
  other vias: 4.08,82.05 4.08,8.39 89.81,4.58 89.81,84.59
  pour Top: -1.11,90.5 -1.11,-0.5 94.89,-0.5 94.89,90.5
  pour Route15: -3.79,93.91 -3.79,-4.77 99.69,-4.77 99.69,93.91
I2C_SCL  (via drill 0.35)
  Top 0.152: U7.30 41.23,44.13 40.97,44.4 39.79,44.4 39.53,44.13 v39.26,44.13 38.88,44.51 R26.2 | U3.2 v36.15,47.73 v36.16,47.73
  Route2 0.152: v36.16,47.73 37.57,46.32 37.57,44.8 38.22,44.15 39.24,44.15 v39.26,44.13
I2C_SDA  (via drill 0.35)
  Top 0.152: U7.29 41.73,44.07 41.37,44.42 41.37,44.73 R25.2 40.2,45.9 v39.99,45.9 | v37.55,47.72 37.17,47.72 37.03,47.85 37.03,48.53 U3.4
  Route2 0.152: v39.99,45.9 39.85,46.03 39.85,47.21 39.34,47.72 v37.55,47.72
I_BATT  (via drill 0.3)
  Top 0.152: U7.15 49.67,40.77 48.45,40.77 v48.2,41.02 | v23.55,71.12 21.82,71.12 U4.2
  Route15 0.152: v48.2,41.02 48.02,41.21 40.74,41.21 37.54,44.41 32.77,44.41 28.8,48.38 28.8,59 25.97,61.84 25.97,68.71 v23.55,71.12
L1_CHG
  Top 0.152: R4.1 8.73,63.44 12.39,63.44 | 12.39,63.44 12.81,63.44 13.4,62.85 13.4,62.66 14.02,62.05 U2.P$16 | R3.1 12.39,64.2 12.39,63.44
L1_FAULTN
  Top 0.152: R6.1 13.9,62.76 14.52,62.14 U2.P$15
L1_PROG
  Top 0.152: R7.2 17.28,61.79 16.25,61.79 15.82,61.36 U2.P$13
  Top 0.254: R7.2 19.29,63.81 R37.2
LED1  (via drill 0.3)
  Top 0.152: U7.18 47.23,44.32 v47.44,44.53 | v45.06,52.27 45.06,53.31 R28.1
  Route15 0.152: v47.44,44.53 46.05,45.92 46.05,50.9 45.06,51.89 v45.06,52.27
LED2  (via drill 0.3)
  Top 0.152: U7.19 46.73,44.42 v46.63,44.52 | v42.93,52.35 42.93,53.3 R29.1
  Route15 0.152: v46.63,44.52 45.74,45.41 45.74,50.78 44.54,51.98 43.11,51.98 42.92,52.17 v42.92,52.34 v42.93,52.35
LED3  (via drill 0.3)
  Top 0.152: U7.20 46.23,44.1 v45.87,44.47 | v40.86,52.35 R30.1
  Route15 0.152: v45.87,44.47 45.44,44.9 45.44,50.65 44.41,51.67 41.33,51.67 40.86,52.15 v40.86,52.35
LED4  (via drill 0.3)
  Top 0.152: U7.23 44.72,43.92 45.11,44.31 v45.11,44.45 | R31.1 39.07,53.82 v39.07,52.8
  Route15 0.152: v45.11,44.45 45.11,50.54 44.35,51.3 39.52,51.3 39.07,51.74 v39.07,52.8 | v39.07,52.8
MINX_1  (via drill 0.3, 0.38)
  Top 0.152: v17.06,45.85 16.36,45.85 16.06,45.55 U10.16 | U7.37 38.26,39.28 36.64,39.28 v36.43,39.48
  Route2 0.152: v36.43,39.48 36.42,39.5 35.14,39.5 30.04,44.6 19.39,44.6 18.13,45.85 v17.06,45.85
MINX_2  (via drill 0.3, 0.38)
  Top 0.152: U10.15 17.25,44.47 17.62,44.84 v17.62,45.17 | v36.38,38.69 36.45,38.76 U7.38
  Route2 0.152: v17.62,45.17 18.39,45.17 19.26,44.3 29.91,44.3 35.52,38.69 v36.38,38.69
MINY_1  (via drill 0.3)
  Top 0.152: U11.16 87.95,60.21 87.95,59.04 v87.95,58.45 | U7.41 40.43,37.26 v40.57,37.12
  Route15 0.152: v40.57,37.12 40.89,37.12 41.27,36.74 55.34,36.74 58.48,39.88 76.12,39.88 87.25,50.99 87.25,57.74 v87.95,58.45
MINY_2  (via drill 0.3, 0.35)
  Top 0.152: v88.59,58.96 v88.59,58.97 U11.15 | U7.42 38.29,36.77 39,36.77 39.4,36.36 v40.57,36.36
  Route15 0.152: v40.57,36.36 40.98,36.36 41.06,36.44 55.47,36.44 58.59,39.56 76.24,39.56 87.55,50.87 87.55,57.18 88.6,58.23 88.6,58.95 v88.59,58.96
MINZ_1  (via drill 0.3, 0.38)
  Top 0.152: v17.38,40.34 17.15,40.57 U10.9 | U7.43 37.25,36.26 v36.99,36.52
  Route2 0.152: v36.99,36.52 18.4,36.52 17.38,37.55 v17.38,40.34
MINZ_2  (via drill 0.3, 0.38)
  Top 0.152: v17.31,41.21 16.07,41.21 U10.10 | U7.44 37.16,35.76 36.96,35.96 36.75,35.96 v35.66,37.05
  Route2 0.152: v35.66,37.05 34.42,37.05 34.19,36.83 18.55,36.83 17.68,37.69 17.68,39.84 17.95,40.1 17.95,40.58 17.61,40.92 17.6,40.92 v17.31,41.21
MOX_1  (via drill 0.3)
  Top 0.305: U10.2 8.56,44.47 v8.11,44.92
  Route2 0.305: v8.11,44.92 7.72,45.31 7.72,58.81 6.81,59.72 J6.2
MOX_2  (via drill 0.3)
  Top 0.305: U10.4 v8.05,43.17 v8.05,43.18
  Route2 0.305: v8.05,43.18 7.89,43.02 3.76,43.02 J7.3
MOX_MID
  Route2 0.305: J6.3 3.92,55.88 3.92,47.95 J7.2
MOY_1  (via drill 0.35)
  Top 0.305: U11.2 88.59,53.29 88.77,53.12 88.77,52.3 v88.78,52.29
  Route2 0.305: v88.78,52.29 88.78,49.12 87.51,47.85 87.51,43.23 J8.2
MOY_2  (via drill 0.35)
  Top 0.305: v89.89,53.1 U11.4
  Route2 0.305: J9.3 91.41,31.17 92.98,32.75 92.98,49.33 89.87,52.43 89.87,53.08 v89.89,53.1
MOY_MID
  Route2 0.305: J9.2 90,29.89 90,43.2 J8.3
MOZ_1  (via drill 0.3)
  Top 0.305: U10.7 7.46,41.22 v7.19,40.95
  Route2 0.305: v7.19,40.95 4.99,38.76 J10.2
MOZ_2  (via drill 0.3)
  Top 0.305: U10.5 8.28,42.52 v7.85,42.09
  Route2 0.305: v7.85,42.09 7.85,21.5 6.05,19.69 3.77,19.69 J11.3
MOZ_MID
  Route2 0.305: J11.2 4.98,25.26 3.7,26.54 3.7,30.15 J10.3
MXZ_EN  (via drill 0.3, 0.38)
  Top 0.152: v10.28,45.83 10.28,45.14 U10.1 | U7.6 46.64,36.26 46.25,36.65 v46.25,37.29
  Route2 0.152: v38.52,42 37.29,42 36.73,41.44 33.66,41.44 30.19,44.91 19.52,44.91 17.95,46.47 10.91,46.47 v10.28,45.83
  Route15 0.152: v46.25,37.29 46.25,38.51 44.27,40.49 39.93,40.49 38.52,41.91 v38.52,42
MY_EN  (via drill 0.3)
  Top 0.152: U7.9 49.68,37.74 49.69,37.73 50.58,37.73 v51.54,38.69 | v88.08,52.74 87.94,52.89 U11.1
  Route2 0.152: v51.54,38.69 83.02,38.69 87.12,42.8 87.12,51.62 88.08,52.58 v88.08,52.74
N$1
  Top 0.152: U1.8 32.57,39.9 32.57,38.84 U1.7 30.62,38.73 29.34,37.45 29.34,34.82 28.2,33.69 JP6.1
N$2
  Top 0.152: U3.21 34.86,50.24 34.78,50.31 34.78,52.38 C4.1
N$3
  Top 0.254: 32.05,69.94 U6.10 U6.11 32.31,69.29 32.05,69.55 32.05,69.94 | 32.05,69.94 31.53,69.94 30.75,70.72 C22.1 30.63,70.95 L3.1
N$4
  Top 0.61: J14.1 5.97,67.64 J15.2
N$5
  Top 0.152: L1.2 17.7,55.55 17.19,56.07 17.19,57.09 U2.P$8
N$6
  Top 0.152: C5.1 34.43,49.12 34.6,48.95 U3.24
N$7  (via drill 0.3, 0.38)
  Top 0.152: 12.26,59.01 12.66,59.01 12.96,59.31 U2.P$4 | 12.26,59.01 C20.2 | L1.1 15.47,56.77 v14.98,57.26 | v12.84,57.74 12.26,58.33 12.26,59.01
  Route15 0.152: v14.98,57.26 13.33,57.26 v12.84,57.74
N$8
  Top 0.152: U1.1 27.75,39.94 | 27.75,39.94 U1.2 | JP5.2 27.77,39.96 27.75,39.94
N$9
  Top 0.152: C20.1 12.6,60.31
  Top 0.203: 12.6,60.31 U2.P$2
N$10
  Top 0.305: R19.2 Q2.1
N$11
  Top 0.152: C19.1 13.47,61.12 U2.P$1
N$12
  Top 0.305: Q5.4 83.69,13.92 82.16,15.45 78.55,15.45 77.48,16.52 Q2.3 77.48,17.78 78.14,18.44 R20.2
N$13
  Top 0.152: 13.36,56.98 13.4,56.98 14.52,58.09 U2.P$6 | R2.1 12.04,57.41 12.45,57.01 13.36,57.01 13.36,56.98 | 13.36,56.98 13.36,55.86 R1.2
N$14
  Top 0.254: U6.12 32.02,68.64 31.54,69.12 C22.2
N$15
  Top 0.305: U7.55 43.23,30.3 L2.2
N$16
  Top 0.152: R5.1 15.93,63.62 15.02,62.71 U2.P$14
N$17
  Top 0.152: R41.2 22.65,60.74 22.19,60.28 21.11,60.28 R40.2 19.95,60.1 19.66,59.81 U2.P$10
N$18  (via drill 0.35)
  Top 0.305: Q9.1 50.96,59.42 R21.2
  Top 0.406: R21.2 50.96,56.74 v51.07,56.62 | v56.35,56.66 57.51,56.66 Q1.3
  Bottom 0.406: v51.07,56.62 56.32,56.62 v56.35,56.66
N$19
  Top 0.381: U8.6 61.64,74.3 62.07,73.87
  Top 0.406: R23.1 62.34,73.6 62.07,73.87
N$20
  Top 0.305: 31.36,7.27 32.28,6.35 32.28,6.24 32.27,6.23 32.27,5.73 32.28,5.72 J2.1
  Top 0.406: D2.2 30.12,12.82 32,10.94 32,7.91 31.36,7.27 C11.1
N$21  (via drill 0.3)
  Top 0.152: J17.2 49.23,83.39 v49.39,83.23
  Route2 0.152: v49.39,83.23 49.39,83.03 49.09,82.72 49.09,82.28 51.2,80.16 90.87,80.16 93.38,77.65 93.38,75.77 92.75,75.14 92.2,75.14 91.41,74.36 J18.3
N$22  (via drill 0.3)
  Top 0.152: J17.3 48.58,83.38 v48.42,83.22
  Route2 0.152: v48.42,83.22 48.42,83.06 48.75,82.72 48.75,82.17 51.07,79.86 90.75,79.86 93.08,77.53 93.08,75.9 92.62,75.45 92.16,75.45 91.41,76.2 J18.5
N$23
  Top 0.305: Q1.1 59.41,54.17 R36.2
N$27
  Top 0.152: LED1.C 45.05,56.74 45.06,56.75
  Top 0.305: 45.06,56.75 R28.2
N$29
  Top 0.305: U7.1 49.68,32.2 50.3,31.57 X1.1 53.8,31.57 C32.1
N$31
  Top 0.305: Q3.3 15.16,33.24 Q6.4 18.35,33.11 R8.1
N$32
  Top 0.305: Q9.3 51.74,63.09 52.06,63.41 53.8,63.41 U8.1
N$33
  Top 0.305: R11.1 17.55,37.81 17.36,37.62 17.36,36.76 17.02,36.42 16.29,36.42 Q3.1
N$34
  Top 0.305: R15.1 14.04,21.75 14.04,22.41 13.51,22.94 13.11,22.94 Q4.1
N$35
  Top 0.305: Q8.3 23.4,13.91 19.14,9.66 K4.5
  Bottom 1.016: D3.A 10.44,8.69 K4.5
N$36  (via drill 0.3)
  Top 0.152: U5.ANT 67.97,25.94 v67.97,24.41
  Route2 0.203: J4.1 58.82,13.33 67.97,22.48 v67.97,24.41
N$37  (via drill 0.35)
  Top 0.152: U5.RXON 73.95,27.26 v74.2,27.51 | v77.72,27.51 77.95,27.27 U5.GPIO_0
  Route2 0.152: v74.2,27.51 v77.72,27.51
N$39  (via drill 0.35)
  Top 0.152: U5.TXON 71.97,25.97 71.97,27.46 v72.57,28.07 | v78.99,28.07 79.62,28.07 79.95,27.73 U5.GPIO_1
  Route2 0.152: v72.57,28.07 v78.99,28.07
N$40  (via drill 0.35)
  Top 0.406: J17.1 49.88,83.67 50.05,83.51 50.05,83.5 v50.7,82.85
  Route15 0.406: v50.7,82.85 82.71,82.85 J18.6
N$41  (via drill 0.76)
  Route2 1.016: J5.3 43.52,13.41 65.94,35.84 65.94,36.84 v65.91,36.87
  Bottom 1.016: J5.8 J5.7 56.78,83.33 65.91,74.2 v65.91,36.87 | J5.4 J5.3
N$43
  Top 0.152: 43.39,26.8 43.57,26.62 L2.1 43.86,25.44 C31.2
  Top 0.305: U7.53 42.23,30.81 41.28,29.86 C30.2 41.28,28.7 41.41,28.57 41.91,28.57 42.09,28.39 42.09,28.1 43.39,26.8
N$44
  Top 0.152: 51.56,34.1 X1.2
  Top 0.305: U7.2 51.4,34.26 51.56,34.1 | X1.2 53.52,34.07 C33.1
N$45
  Top 0.305: LED2.C 42.91,56.59 R29.2
N$46
  Top 0.254: U6.3 39.8,68.64 39.96,68.48 41.29,68.48 41.49,68.69 41.49,69.88 41.66,70.04 42.57,70.04 R17.2 43.75,71.22 C26.1
N$47
  Top 0.152: LED3.C 40.89,55.03 R30.2
N$48
  Top 0.305: LED4.C R31.2
N$49
  Top 0.152: R32.2 25.82,85.63 25.82,84.44 24.59,84.44 LED5.C
N$50
  Top 0.152: R33.2 LED6.C
N$51
  Top 0.254: U6.4 40.59,69.29 C25.1
N$52
  Top 0.254: U6.2 40.08,67.99 40.5,67.57 R12.1 R14.2
N$53
  Top 0.305: JP8.1 25.88,81.65 LED5.A
N$54
  Top 0.152: R41.1 20.03,61.71 19.94,61.62 19.94,61.03 19.05,60.13 16.78,60.13 16.6,60.31 U2.P$11
N$55
  Top 0.305: JP9.1 22.68,82.77 LED6.A
N$56  (via drill 0.3)
  Top 0.152: U7.3 48.42,34.76 48.37,34.8 v48.33,34.76 | v23.54,63.77 23.5,63.81 R37.1
  Route15 0.152: v48.33,34.76 47.84,35.25 40.37,35.25 37.8,37.83 37.8,42.87 37.07,43.59 31.6,43.59 27.51,47.69 27.51,52.22 25.15,54.58 25.15,63.09 24.46,63.78 v23.54,63.78 v23.54,63.77
N$58
  Top 0.305: Q4.3 12.64,20.53 13.63,20.53 14.1,20.06 Q7.4 15.35,19.43 16.98,17.8 R9.1
N$59
  Bottom 1.016: J5.2 J5.1 76.08,8.5 J16.1
N$60
  Top 0.305: JP10.1 35.64,58.19 LED4.A 40.86,58.19 LED3.A 42.74,58.21 LED2.A LED1.A
P_GOOD  (via drill 0.3)
  Top 0.152: U7.17 47.71,43.23 47.71,43.98 v48.24,44.51 | v57.35,60.99 57.11,61.23 R22.2
  Top 0.381: R22.2 55.91,63.23 U8.10
  Route2 0.152: v57.35,60.99 57.35,56.2 55.93,54.78 53.74,54.78 50.94,51.98 50.94,47.91 48.24,45.22 v48.24,44.51
PGOOD
  Top 0.254: U6.6 40.81,70.59 41.25,71.04 R17.1
PL_ENABLE  (via drill 0.3)
  Top 0.152: U7.63 47.23,30.92 47.72,30.43 49.57,30.43 v49.77,30.23
  Route15 0.203: v49.77,30.23 78.95,30.23 84.88,24.3 84.88,18.83 88.31,15.4 J13.2
PL_PWR_ENAB  (via drill 0.3)
  Top 0.152: U7.62 46.73,30.86 48.12,29.47 v49.72,29.47 | v69.33,19.08 69.33,18.15 R18.1
  Top 0.305: R18.1 69.59,17.88 R19.1
  Route15 0.203: v49.72,29.47 66.58,29.47 68.95,27.1 68.95,19.38 69.26,19.08 v69.33,19.08
PL_PWR_IN
  Top 0.508: Q5.8 Q5.7 Q5.6 Q5.5 84.51,17.29 84.95,16.85 84.95,13.39 85.92,12.43 90.26,12.43 91.23,13.39 J13.1
PL_UART_RX  (via drill 0.3)
  Top 0.152: U7.40 40.17,37.76 v40.57,38.16
  Route2 0.152: v40.57,38.16 82.17,38.16 85.99,34.33 85.99,20.26 86.86,19.39 87.6,19.39 J13.6
PL_UART_TX  (via drill 0.3)
  Top 0.152: U7.39 38.3,38.27 39.74,38.27 40.16,38.7 40.83,38.7 41.15,38.38 v41.15,37.62
  Route2 0.152: v41.15,37.62 41.36,37.84 82.05,37.84 85.67,34.21 85.67,20.07 86.71,19.04 87.54,19.04 88.64,17.94 J13.4
RF_NIRQ  (via drill 0.3)
  Top 0.152: v71.96,56.85 U5.NIRQ | U7.12 50.55,39.26 v50.93,39.63
  Route15 0.152: v71.96,56.85 71.93,56.83 71.93,55.98 71.11,55.16 71.11,40.52 70.81,40.22 52.82,40.22 51.94,39.34 51.22,39.34 v50.93,39.63
RF_SDN  (via drill 0.3)
  Top 0.152: v51.69,39.89 51.46,39.66 51.46,39.41 50.8,38.74 49.69,38.74 U7.11 | v69.93,56.9 69.93,58.73 U5.SDN
  Route15 0.152: v51.69,39.89 52.34,40.54 70.64,40.54 70.77,40.67 70.77,55.18 69.93,56.02 v69.93,56.9
SPI_CS_MRAM  (via drill 0.3)
  Top 0.152: v50.09,49.13 U12.1 | U7.24 44.23,44.33 v44.33,44.43
  Route2 0.152: v44.33,44.43 44.96,45.06 47.61,45.06 49.4,46.85 49.4,48.44 v50.09,49.13
SPI_CS_RFM  (via drill 0.3)
  Top 0.152: U7.25 43.73,42.17 44.02,41.89 v44.02,41.82 | v73.71,52.58 73.95,52.82 U5.NSEL
  Route2 0.152: v44.02,41.82 44.44,41.4 47.63,41.4 55.04,48.8 55.04,52.01 55.3,52.27 73.4,52.27 v73.71,52.58
SPI_CS_SD  (via drill 0.3)
  Top 0.152: U7.26 43.23,44.28 v43.47,44.52 | J1.2 74.36,74.5 73.54,75.32 70.64,75.32 v70.5,75.18
  Route2 0.152: v43.47,44.52 44.42,45.47 47.43,45.47 48.92,46.95 48.92,50.77 53.93,55.78 53.93,58.62 v70.5,75.18
SPI_MISO  (via drill 0.35)
  Top 0.152: U7.49 40.23,32.89 v39.77,33.35 | v54.38,50.2 52.9,50.2 52.09,49.39 U12.2 52.09,48.35 v51.74,47.99 | v79.95,56.81 U5.SDO | v82.5,76.22 80.35,76.22 79.86,75.72 J1.7
  Route2 0.152: v51.74,47.99 51.74,47.24 48.05,43.55 40.82,43.55 39.73,42.46 39.73,33.39 v39.77,33.35 | v54.38,50.2 54.38,52.38 55.11,53.12 75.75,53.12 79.45,56.81 v79.95,56.81 79.95,63.48 80.61,64.14 81.64,64.14 82.89,65.38 82.89,75.83 v82.5,76.22
SPI_MOSI  (via drill 0.35)
  Top 0.152: U7.50 40.73,33.54 v40.51,33.76 | v54.64,53.48 54.64,54.82 U12.5 | v78.01,57.01 78.01,58.7 U5.SDI 77.95,60.8 76.58,62.17 v76.16,62.17 | v72.71,76.08 73.85,76.08 75.38,74.55 75.38,73.9 J1.3
  Route2 0.152: v40.51,33.76 40.03,34.24 40.03,38.7 40.87,39.53 40.87,42.73 41.08,42.95 48.43,42.95 53.66,48.18 53.66,52.97 54.17,53.48 v54.64,53.48 75.56,53.48 78.01,55.92 v78.01,57.01 | v76.16,62.17 74.31,64.02 72.42,64.02 71.27,65.17 71.27,74.67 72.7,76.1 v72.71,76.08
SPI_SCK  (via drill 0.35)
  Top 0.152: U5.SCK 75.91,58.72 75.94,58.69 v75.94,57.07 | U7.36 v40.27,39.76 v40.29,39.77 | v53.36,53.51 U12.6 | v77.66,75.72 J1.5
  Route2 0.152: v40.29,39.77 40.29,42.59 40.95,43.25 48.25,43.25 53.36,48.36 v53.36,53.51 53.93,54.09 75.57,54.09 75.94,54.45 v75.94,57.07 75.94,60.19 80.19,64.44 81.52,64.44 82.58,65.5 82.58,74.74 80.69,76.64 78.29,76.64 77.66,76 v77.66,75.72
SWCLK  (via drill 0.3, 0.35)
  Top 0.152: U7.57 44.23,32.81 44.03,33.01 v44.03,33.6 | R34.1 v49.25,25.56 v49.25,25.55
  Route15 0.152: v44.03,33.6 44.49,33.6 47.47,33.6 48.94,32.14 48.94,28.7 49.25,28.38 v49.25,25.55 49.25,22.17 55,16.43 55,16.39 55.01,16.38 55.01,11.39 55.84,10.55 62.52,10.55 64.72,8.35 68.89,8.35 J12.4
SWDIO  (via drill 0.3)
  Top 0.152: v44.72,33.07 44.73,33.06 U7.58
  Route15 0.152: v44.72,33.07 47.57,33.07 48.63,32.01 48.63,22.36 54.7,16.3 54.7,11.27 55.72,10.25 62.39,10.25 65.8,6.84 J12.2
USB_N  (via drill 0.3)  (3 unrouted)
  Top 0.152: J2.2 32.93,6.01 32.9,6.04 | U7.45 36.88,35.26 | 36.88,35.26 36.73,35.41 | 36.73,35.41 | 36.88,35.26
  Route2 0.152: v36.74,35.42 35.8,35.42 35.57,35.2 34.49,35.2 33.15,33.85 33.15,6.57 32.9,6.32 32.9,5.99
  other vias: 32.88,5.98
USB_P  (via drill 0.3)  (4 unrouted)
  Top 0.152: J2.3 33.58,5.95 33.65,6.03 | U7.46 36.88,34.76 36.77,34.66
  Route2 0.152: v36.75,34.67 35.76,34.67 35.53,34.89 34.62,34.89 33.47,33.74 33.47,6.57 33.67,6.37 33.67,5.99
  other vias: 33.67,6
V_CH
  Top 0.305: D1.2 39.53,15.21 44.39,10.35 45.83,10.35 J3.VBUS
VBATT  (via drill 0.3, 0.35, 0.38)
  Top 0.152: C24.1 17.26,58.96 | 17.26,58.96 17.26,58.48 18.53,57.21 20.49,57.21 20.89,57.62 20.89,58.37 R40.1 | U2.P$9 16.07,59.07 16.18,58.96 17.26,58.96
  Top 0.254: v40.61,71.38 40.47,71.24 U6.7 | R40.1 21.84,58.4 v22.39,57.84 | U11.12 90.54,61.18 90.12,61.6 C13.1 | C14.1 C13.1 | C13.1 89.58,62.55 v88.54,63.59
  Top 0.272: U10.12 16.06,42.49 C10.1 21,42.49 C12.1
  Top 0.305: R21.1 52.69,57.84 Q9.2 53.66,59.59 54.15,60.08 v54.15,61.4
  Top 0.406: R35.2 17.86,72.26 v17.87,72.27 18.15,72.27 18.38,72.04 U4.4
  Top 0.508: 15.61,72.22 R35.2 | C12.1 23.11,42.48 v23.38,42.76
  Top 0.61: 15.61,72.22 9.97,72.22 7.69,69.93 7.69,66.78 5.86,64.96 3.14,64.96 2.1,66 J15.1
  Top 1.016: K4.1 11.73,2.04 14.29,4.59 24.7,4.59 K4.14
  Route15 0.305: v88.54,63.59 62.15,63.59 60.28,61.72 54.65,61.72 54.64,61.71 54.46,61.71 v54.15,61.4
  Bottom 0.406: v54.15,61.4 53.09,61.4 46.02,61.4 45.86,61.56 45.86,66.12 v40.61,71.38 36.67,75.32 25.18,75.32 22.13,72.27 v17.87,72.27 | 6.86,55.45 8.76,55.45 8.78,55.43 19.98,55.43 v22.39,57.84
  Bottom 0.508: v23.38,42.76 23.38,40.33 22.37,39.31 12.02,39.31
  Bottom 1.016: K4.1 10.44,3.01 D3.C 12.14,5.08 12.87,5.8 12.87,11.65 7.11,17.4 7.11,33.39 12.02,38.3 12.02,39.31 12.02,48.83 6.86,54 6.86,55.45 6.86,62.86 J15.1
VBATT_IN  (via drill 0.35, 0.38)
  Top 0.406: D2.1 30.12,21.34 v31.92,19.54 | v35.07,19.54 35.07,17.57 D1.1
  Top 0.508: v26.69,60.24 26.69,58.16 R38.2
  Top 0.61: D2.1 30.12,24.36 v29.08,25.4
  Bottom 0.406: v31.92,19.54 v35.07,19.54
  Bottom 0.508: J14.2 2.12,72.04 4.13,70.03 8.95,70.03 12.41,66.58 12.41,66.44 13.38,65.47 23.93,65.47 26.69,62.71 v26.69,60.24
  Bottom 0.61: v29.08,25.4 26.55,25.4 24.77,27.18 24.77,58.32 v26.69,60.24
  Bottom 1.016: J5.6 J5.5 10.08,78.22 5.51,78.22 J14.2
VBURN1
  Top 0.508: Q6.5 Q6.6 Q6.7 Q6.8 8.14,27.64 6.21,27.64 J10.6 J10.4
VBURN2
  Top 0.508: Q7.5 Q7.6 Q7.7 Q7.8 8.87,14.93 8.07,14.13 5.73,14.13 4.98,14.88 J11.6 J11.4
VBURN_A_IN  (via drill 0.38)
  Top 0.305: R8.2 17,31.39 16.55,31.84 Q6.3 Q6.2 Q6.1 | 14.19,16.89 Q7.2 Q7.1 | 14.19,16.89 15.55,16.89 16.34,16.09 R9.2 | Q7.3 14.1,16.97 14.19,16.89
  Top 0.508: v14.65,14.21 14.65,15.07 Q7.1 14.1,16.97 | Q7.2 Q7.3 11.59,18.16 11.59,19.41 10.38,20.61 8.59,20.61 7.73,21.47 7.73,23.53 8.43,24.23 9.76,24.23 11.84,26.3 13.71,26.3 15.03,27.62 Q6.1
  Bottom 0.508: v14.65,14.21 14.65,7.03 K4.11
VINT_1
  Top 0.254: U10.11 16.04,41.89 15.33,41.89 15,42.22 15,43.62 15.2,43.82 U10.14
  Top 0.272: U10.14 17.3,43.82 17.87,44.39 19.05,44.39 C36.1
VINT_2
  Top 0.152: U11.14 89.24,59.4 89.65,58.99 90.92,58.99 91.19,59.26 U11.11
  Top 0.254: U11.14 89.22,60.23 89.22,61.09 88.07,62.24 C37.1
VREG_IN  (via drill 0.35, 0.38)
  Top 0.254: 21,67.65 v21.12,67.65
  Top 0.305: U6.14 32.07,67.34 C40.1 | C41.1 25.72,67.65 | C42.1 28,67.7 27.96,67.65 | C38.1 27.21,67.61 27.25,67.65 | C39.1 29.6,67.5 29.45,67.65 29.8,67.99 U6.13 U6.14 | U6.14 | C18.1 33.62,66.11 33.62,66.83 33.23,67.22 U6.14 | C21.1 33.98,67.34 U6.14
  Top 0.381: 46.73,65.87 49.17,65.87 49.29,66 49.39,65.9 U8.2 49.39,62.31 49.11,62.03 47.84,62.03 47.72,61.91 C6.1
  Top 0.406: 19.37,69.27 21,67.65 | v21.12,67.65 25.72,67.65 27.25,67.65 27.96,67.65 29.45,67.65 | 46.73,65.87 46.73,64.27 45.94,63.48 C7.1 44.66,62.57 v44.36,62.27 | C21.1 37.27,65.34 v37.28,65.35
  Top 0.508: U4.5 19.42,69.32 19.37,69.27 15.83,69.27 R35.1
  Route15 0.406: v37.28,65.35 37.28,64.38 39.88,61.78 43.87,61.78 v44.36,62.27
VSOLAR  (via drill 0.3)
  Top 0.152: R2.2 10.45,59.12 10.58,59.25 10.58,59.88 10.9,60.2 11.03,60.2 | C17.1 9.04,60.03 10.05,60.03 10.62,60.6
  Top 0.203: R4.2 8.64,61.71 8.64,60.88 10.34,60.88 10.62,60.6 11.03,60.2 11.4,59.83 13.45,59.83 U2.P$3
  Top 0.508: 8.64,61.71 8.28,62.07 5.67,62.07 v5.66,62.05 6.3,62.05 6.3,61.2 7.68,59.82 C17.1 9.76,59.82 10.45,59.12
  Top 0.813: J8.5 85.95,52.4 85.95,52.55 v85.9,52.55 v85.9,52.54 | v29.56,51.64 28.64,50.71 v26.48,50.71
  Route15 0.508: J6.5 0.97,56.28 0.97,61.03 1.97,62.04 5.65,62.04 v5.66,62.05
  Route15 0.813: v85.9,52.54 85.9,58.15 83.97,60.07 31.97,60.07 29.56,57.66 v29.56,51.64 | v26.48,50.71 6.54,50.71 J6.5
  Bottom 0.762: J6.5 2.61,51.73 1.06,50.18 1.06,43.65 1.06,43.64 1.06,43.19 J7.5 2.43,41.61 2.43,38.93 2.45,38.91 2.45,36.03 0.98,34.55 0.98,30.79 2.45,29.32 J10.5 0.97,27.38 0.97,16.64 1.79,15.82 J11.5 | J9.5 92.94,35.38 92.94,45.44 92.91,45.44 J8.5
WDT_WDI  (via drill 0.3)
  Top 0.152: R27.1 31.14,37.24 31.39,37.49 32.65,37.49 U1.6 34.08,37.46 v34.12,37.5 | v36.92,40.22 38.24,40.22 U7.35
  Route15 0.152: v34.12,37.5 34.87,38.26 34.87,39.22 35.87,40.22 v36.92,40.22

## Text on the board
tPlace: PL_USB | LED_5V | Rev B | LED_3V3 | PL_USB | FOOT | LEDS | X1 | X2 | Y1 | AREF | Z1 | WDT | Y2 | PAYLOAD | Z2 | CH | JTAG | PROG | RAIL
bPlace: Designed By: / Damian Loya / Dominick Montero / Matthew Poole / Tane Tatum / For Issues Contact: / Andrew Gatherer / Special Thanks to: / Dr. Zac Manchester / Max Holliday